# EasyEDA schematic SCH_d_02_e_03.json
TITLE: Sheet_1; REV: 1.0; Date: 2025-02-07; Sheet: 1/1; Drawn By: artem.v.ulyanov; Company: Your Company
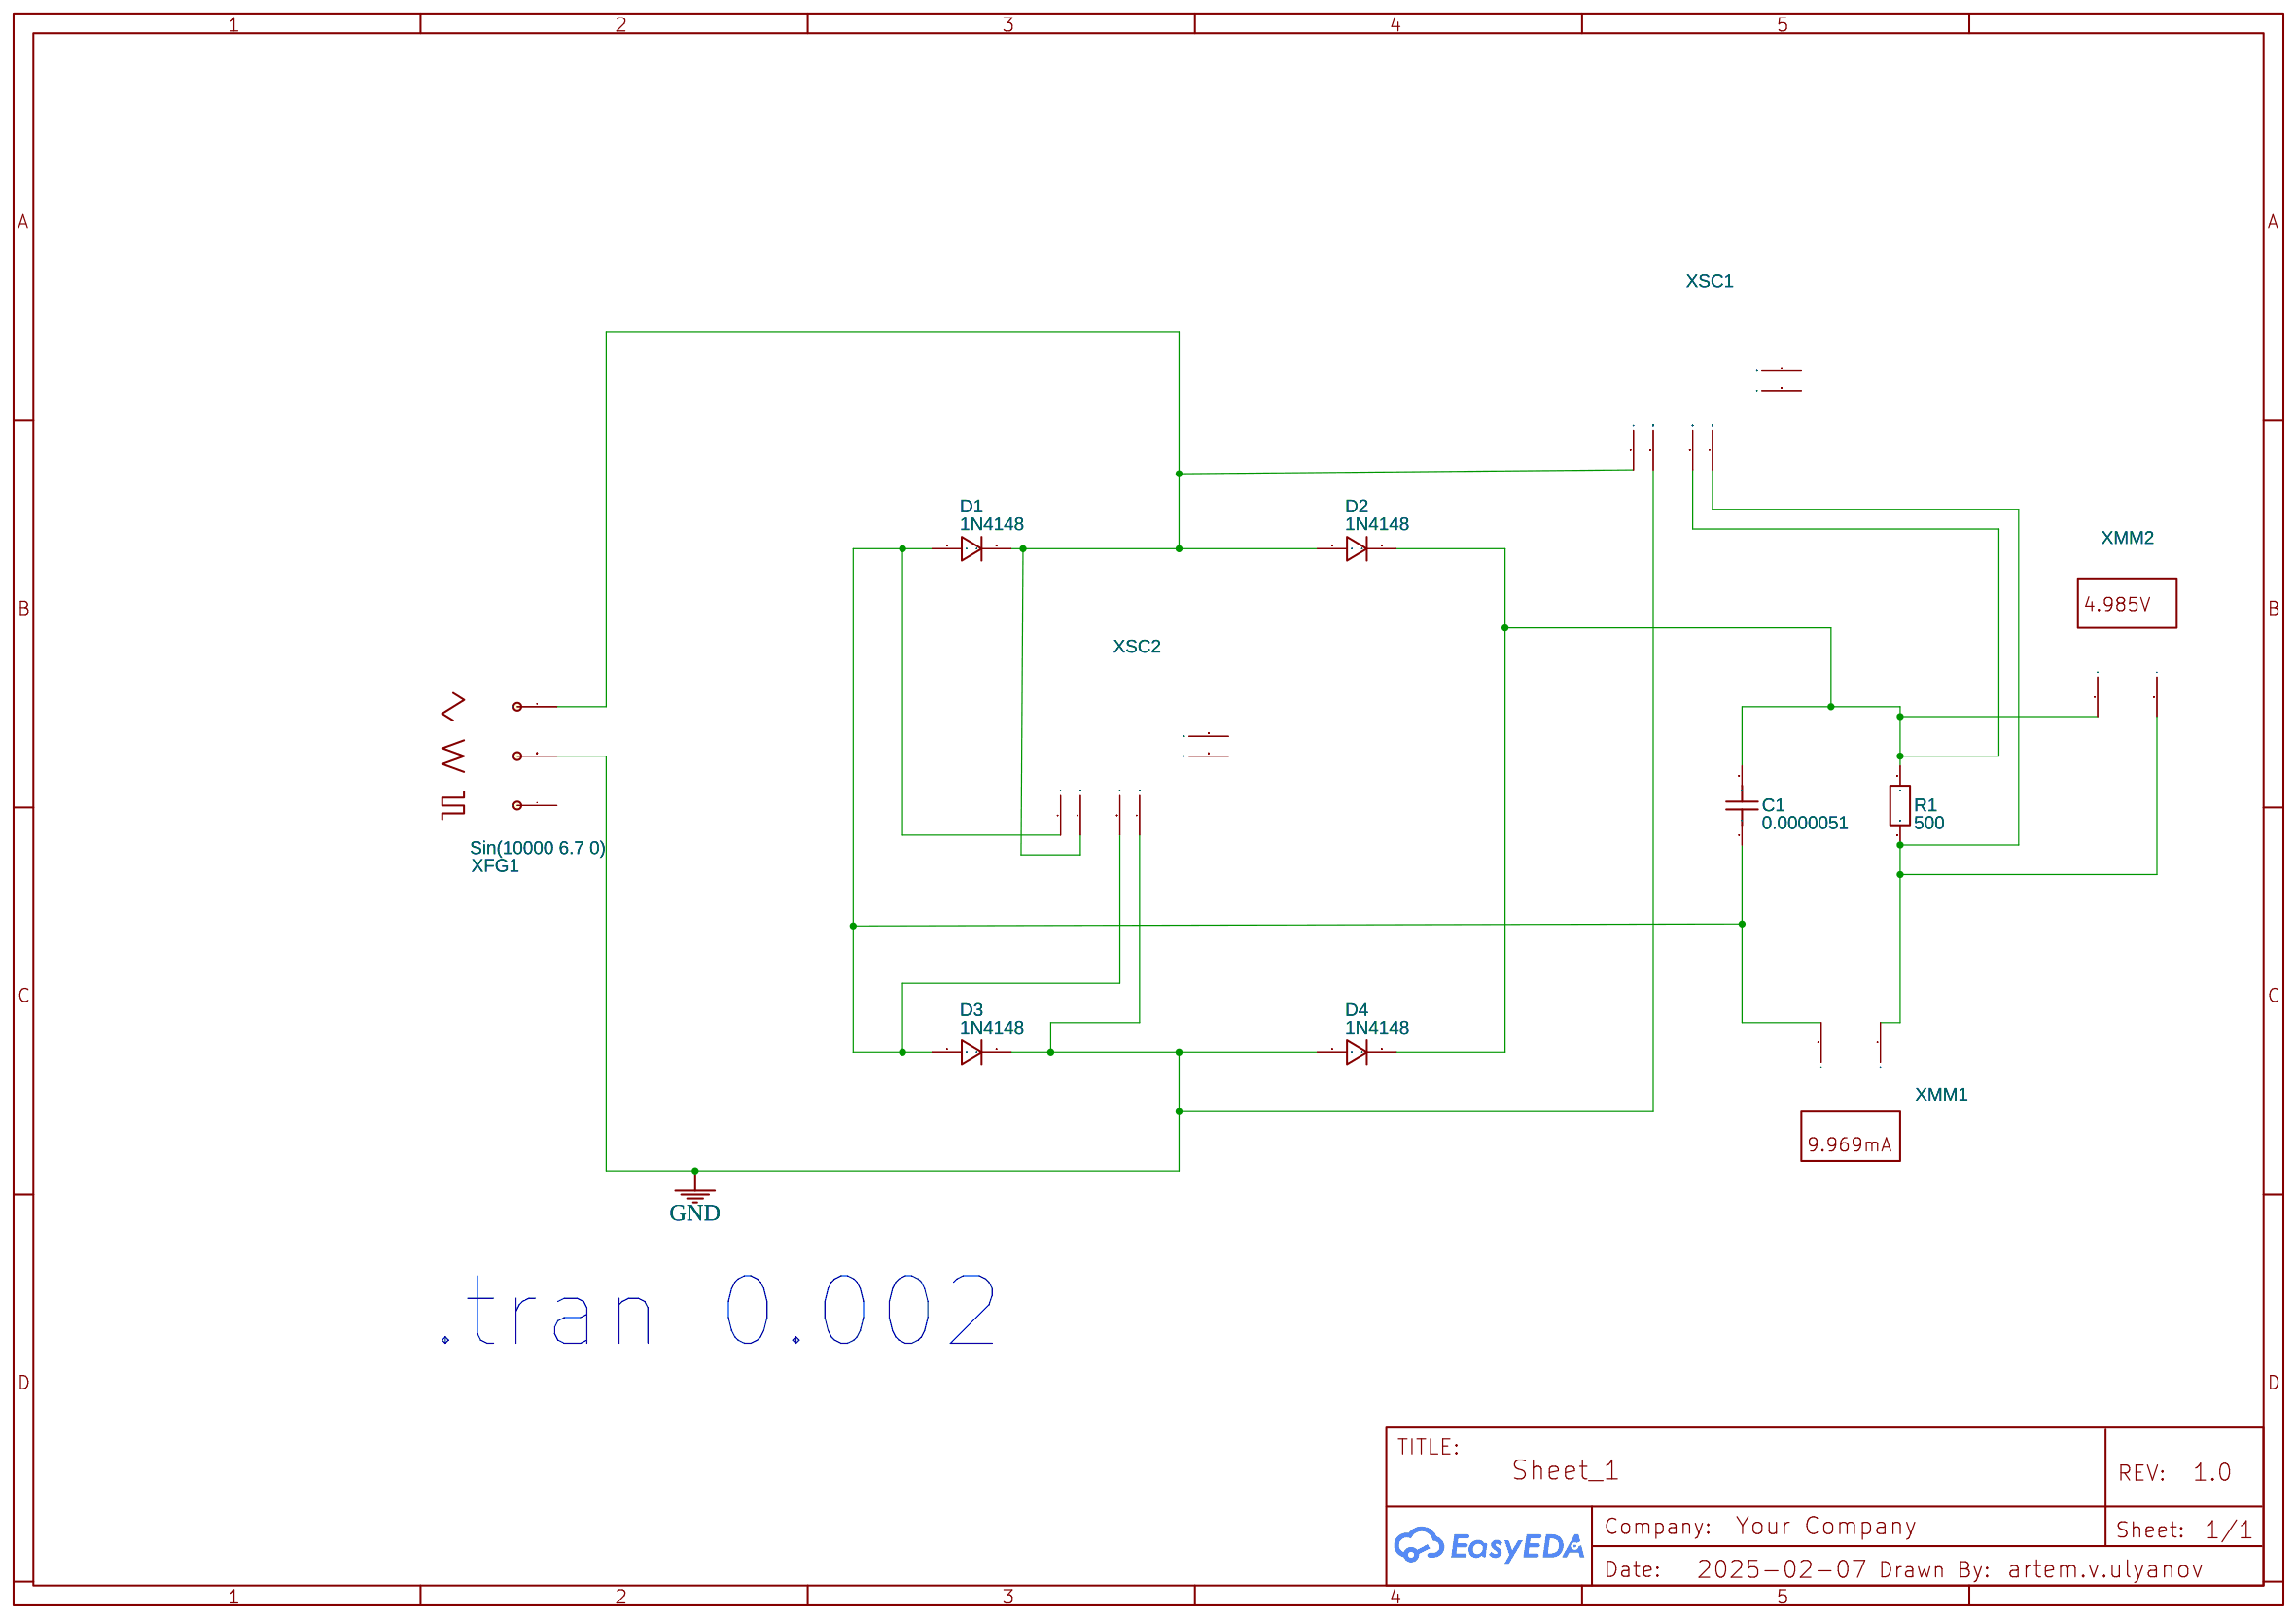
[diagram p0: schematic sheet]

## Parts
C1  0.0000051  [RAD-0.1]
D1  1N4148  [DO-35]
D2  1N4148  [DO-35]
D3  1N4148  [DO-35]
D4  1N4148  [DO-35]
R1  500  [R0603]
XFG1  Sin(10000 6.7 0)
XMM1  Multimeter
XMM2  Multimeter
XSC1  Oscilloscope
XSC2  Oscilloscope

## Library data of the parts
C1 = Capacitor_US: Contributor: EasyEDA; Supplier: YUJING; Capacitance: 1u
D1-D4 = 1N4148: Contributor: EasyEDA
R1 = R_0603_EU: Contributor: LCEDA_Lib
XFG1 = FUNCTIONGENERATOR: Supplier: LCSC; Waveforms: Sine Wave; Frequency: 10000; Duty cycle: 50; Amplitude: 6.7; Offset: 0; Rise/Fall Time: 10; NameDisplay: 1; Contributor: EasyEDA; sim: true
XMM1 = MULTIMETER: Supplier: LCSC; Multimeter Type: Amper; Power Type: AC; Voltmeter resistance: 10μ; Ammeter resistance: 1G; NameDisplay: 0; Contributor: EasyEDA; sim: true
XMM2 = MULTIMETER: Supplier: LCSC; Multimeter Type: Volt; Power Type: AC; Voltmeter resistance: 10μ; Ammeter resistance: 1G; NameDisplay: 0; Contributor: EasyEDA; sim: true
XSC1 XSC2 = OSCILLOSCOPE: Contributor: EasyEDA; NameDisplay: 0; sim: true

## Nets
GND: D3.2(K) D4.1(A) XFG1.COM XSC1.2(GND1) XSC2.4(GND2)
Net-(C1-1): C1.1 D1.1(A) D3.1(A) XMM1.2(I) XSC2.1(A) XSC2.3(B)
Net-(C1-2): C1.2 D2.2(K) D4.2(K) R1.1 XMM2.1(+) XSC1.3(B)
Net-(D1-2): D1.2(K) D2.1(A) XFG1.+ XSC1.1(A) XSC2.2(GND1)
Net-(R1-2): R1.2 XMM1.1(+) XMM2.2(I) XSC1.4(GND2)

Not connected (* = marked no-connect by the designer): XFG1 -; XSC1 5(T+) 6(T-); XSC2 5(T+) 6(T-)

## Notes on the sheet
- .tran 0.002
